# EAGLE schematic 18650-pi (EAGLE 8.1.0)

## Sheet 1 of 2: Charge
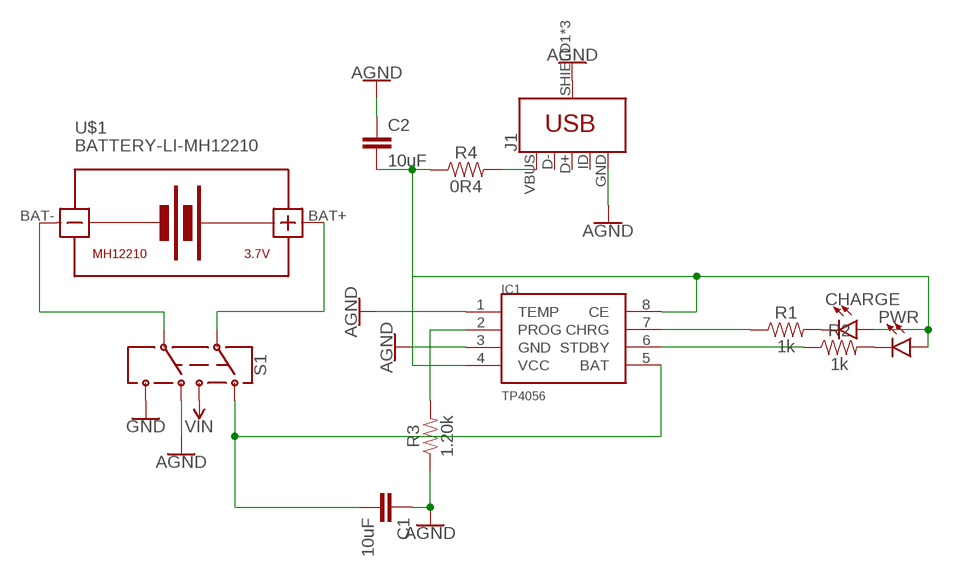
[diagram p0: schematic, sheet 1]

### Parts
C1  10uF  10UF-0603-6.3V-20%  [0603]
C2  10uF  10UF-0603-6.3V-20%  [0603]
CHARGE  LED0603  [LED-0603]
IC1  TP4056  [SOP-8]
J1  USB_MICRO-B_FEMALE-SMT  [USB-B-MICRO-SMD]
PWR  LED0603  [LED-0603]
R1  1k  1KOHM-0603-1/10W-1%  [0603]
R2  1k  1KOHM-0603-1/10W-1%  [0603]
R3  1.20k  1.20KOHM-0603-1/10W-1%  [0603]
R4  0R4  RESISTOR0603  [0603]
S1  SWITCH-DPDT-SMD-AYZ0202  [SWITCH_DPDT_SMD_AYZ0202]
U$1  BATTERY-LI-MH12210  [BATTERY-LI-MH12210]

### Nets
AGND: C1.1 C2.1 IC1.1(TEMP) IC1.3(GND) J1.GND J1.SHIELD1(SHIELD) J1.SHIELD2(SHIELD) J1.SHIELD3(SHIELD) R3.1 S1.4
GND: S1.6 ; also sheet 2
N$1: S1.2 U$1.BAT+
N$2: S1.5 U$1.BAT-
N$3: CHARGE.C R1.2
N$4: PWR.C R2.2
N$5: IC1.2(PROG) R3.2
N$6: IC1.7(CHRG) R1.1
N$7: IC1.6(STDBY) R2.1
N$8: J1.VBUS R4.2
N$9: C2.2 CHARGE.A IC1.4(VCC) IC1.8(CE) PWR.A R4.1
N$11: C1.2 IC1.5(BAT) S1.1
VIN: S1.3 ; also sheet 2
Unconnected: J1.D+ J1.D- J1.ID

## Sheet 2 of 2: Boost
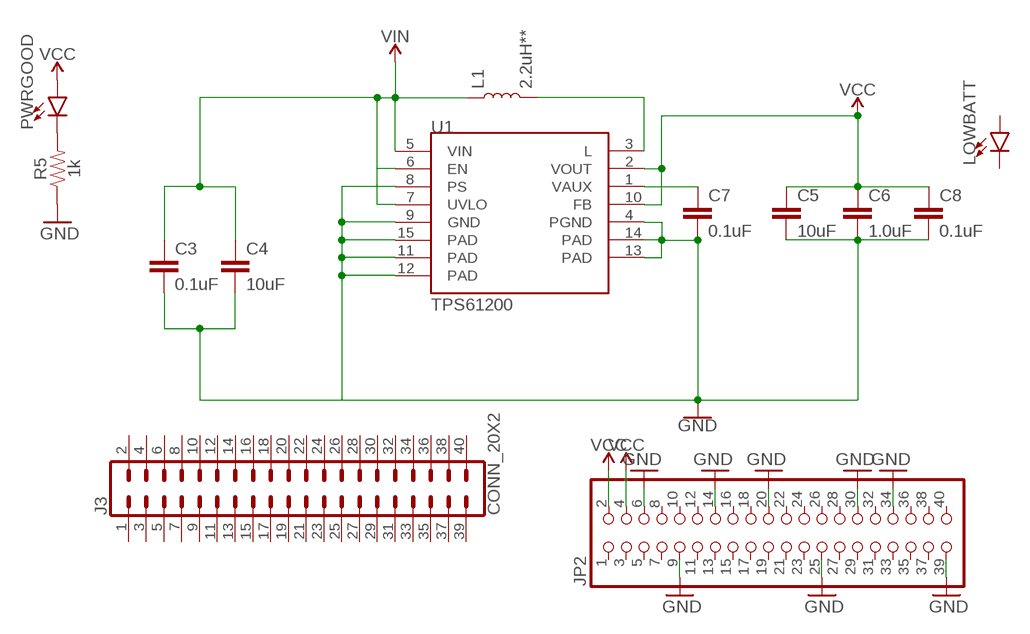
[diagram p1: schematic, sheet 2]

### Parts
C3  0.1uF  0.1UF-0603-25V-(+80/-20%)  [0603]
C4  10uF  10UF-0603-6.3V-20%  [0603]
C5  10uF  10UF-0603-6.3V-20%  [0603]
C6  1.0uF  1.0UF-0603-16V-10%  [0603]
C7  0.1uF  0.1UF-0603-25V-(+80/-20%)  [0603]
C8  0.1uF  0.1UF-0603-25V-(+80/-20%)  [0603]
J3  CONN_20X2  [2X20]
JP2  PINHD-2X20_2.54-SMD  [2X20SMD]
L1  2.2uH**  INDUCTOR-CDRH-4.7UH  [INDUCTOR_4.7UH]
LOWBATT  LED0603  [LED-0603]
PWRGOOD  LED0603  [LED-0603]
R5  1k  1KOHM-0603-1/10W-1%  [0603]
U1  TPS61200  [QFN-10_PAD]

### Nets
GND: C3.2 C4.2 C5.2 C6.2 C7.2 C8.2 JP2.6 JP2.9 JP2.14 JP2.20 JP2.25 JP2.30 JP2.34 JP2.39 R5.1 U1.4(PGND) U1.8(PS) U1.9(GND) U1.11(PAD) U1.12(PAD) U1.13(PAD) U1.14(PAD) U1.15(PAD) ; also sheet 1
N$10: L1.P$2 U1.3(L)
N$12: PWRGOOD.C R5.2
N$14: C7.1 U1.1(VAUX)
VCC: C5.1 C6.1 C8.1 JP2.2 JP2.4 PWRGOOD.A U1.2(VOUT) U1.10(FB)
VIN: C3.1 C4.1 L1.P$1 U1.5(VIN) U1.6(EN) U1.7(UVLO) ; also sheet 1
Unconnected: J3.1 J3.2 J3.3 J3.4 J3.5 J3.6 J3.7 J3.8 J3.9 J3.10 J3.11 J3.12 J3.13 J3.14 J3.15 J3.16 J3.17 J3.18 J3.19 J3.20 J3.21 J3.22 J3.23 J3.24 J3.25 J3.26 J3.27 J3.28 J3.29 J3.30 J3.31 J3.32 J3.33 J3.34 J3.35 J3.36 J3.37 J3.38 J3.39 J3.40 JP2.1 JP2.3 JP2.5 JP2.7 JP2.8 JP2.10 JP2.11 JP2.12 JP2.13 JP2.15 JP2.16 JP2.17 JP2.18 JP2.19 JP2.21 JP2.22 JP2.23 JP2.24 JP2.26 JP2.27 JP2.28 JP2.29 JP2.31 JP2.32 JP2.33 JP2.35 JP2.36 JP2.37 JP2.38 JP2.40 LOWBATT.A LOWBATT.C

## Library data of the parts
C1 C2 C4 C5 = SparkFun-Capacitors:10UF: 10.0µF ceramic capacitors A capacitor is a passive two-terminal electrical component used to store electrical energy temporarily in an electric field.; PROD_ID: CAP-11015
C3 C7 C8 = SparkFun-Capacitors:0.1UF: 0.1µF ceramic capacitors A capacitor is a passive two-terminal electrical component used to store electrical energy temporarily in an electric field.; PROD_ID: CAP-00810
C6 = SparkFun-Capacitors:1.0UF: 1µF ceramic capacitors A capacitor is a passive two-terminal electrical component used to store electrical energy temporarily in an electric field.; PROD_ID: CAP-00868
CHARGE LOWBATT PWR PWRGOOD = SparkFun-LED:LED: LED (Generic) Standard schematic elements and footprints for 5mm, 3mm, 1206, and 0603 sized LEDs. Generic LEDs with no color specified.
IC1 = TP4056:TP4056
J1 = SparkFun-Connectors:USB_MICRO-B: USB Type Micro-B Connector Male/female and PTH/SMT variants SparkFun Products: SparkFun microB USB Breakout <https://www.sparkfun.com/products/12035> SparkFun USB microB Plug Breakout <https://www.sparkfun.com/products/10031> SparkFun ESP8266 Thing <https://www.sparkfun.com/products/13231>; PROD_ID: CONN-11752
J3 = SparkFun-Connectors:CONN_20X2: Multi connection point. Often used as Generic Header-pin footprint for 0.1 inch spaced/style header connections On any of the 0.1 inch spaced packages, you can populate with these: Break Away Headers - Straight <https://www.sparkfun.com/products/116> (PRT-00116) Break Away Male Headers - Right Angle <https://www.sparkfun.com/products/553> (PRT-00553) Female Headers <https://www.sparkfun.com/products/115> (PRT-00115) Break Away Headers - Machine Pin <https://www.sparkfun.com/products/117> (PRT-00117) Break Away Female Headers - Swiss Machine Pin <https://www.sparkfun.com/products/743> (PRT-00743)
JP2 = pinhead-1:PINHD-2X20: PIN HEADER
L1 = SparkFun-Coils:INDUCTOR: Inductors Resist changes in electrical current. Basically a coil of wire. SparkFun Products: SparkFun Load Cell Amplifier - HX711 <https://www.sparkfun.com/products/13879> IOIO-OTG - V2.2 <https://www.sparkfun.com/products/13613>; PROD_ID: NDUC-10146; VALUE: 4.7µH/±30%/1.2A
R1 R2 R5 = SparkFun-Resistors:1KOHM: 1kΩ resistor A resistor is a passive two-terminal electrical component that implements electrical resistance as a circuit element. Resistors act to reduce current flow, and, at the same time, act to lower voltage levels within circuits. - Wikipedia; PROD_ID: RES-07856
R3 = SparkFun-Resistors:1.20KOHM: 1.20kΩ resistor A resistor is a passive two-terminal electrical component that implements electrical resistance as a circuit element. Resistors act to reduce current flow, and, at the same time, act to lower voltage levels within circuits. - Wikipedia; PROD_ID: RES-08413
R4 = SparkFun-Resistors:RESISTOR: Generic Resistor Package
S1 = SparkFun-Switches:SWITCH-DPDT: Double-Pole, Double-Throw (DPDT) Switch Double-pole, double-throw switches. Variant Overview PTH-GPI-152-3013 Used on SparkFun Geiger Counter <https://www.sparkfun.com/products/11345> SMD-AY0202 Surface Mount DPDT Switch <https://www.sparkfun.com/products/597> (COM-00597) Used on e.g. LilyPad Arduino USB - ATmega32U4 Board <https://www.sparkfun.com/products/12049>; PROD_ID: SWCH-08179; SF_SKU: COM-00597
U1 = SparkFun-IC-Power:TPS61200: DC to DC Booster IC-10035; PROD_ID: IC-10035
U$1 = diy-modules:BATTERY-LI-MH12210: Lithium-Ion MH12210 Rechargeable Battery Panasonic NCR18650PF battery datasheet available here: https://industrial.panasonic.com/cdbs/www-data/pdf2/ACI4000/ACI4000C12.pdf Click here to find device on ebay.com <http://www.ebay.com/sch/ncr18650b+battery>